# Altium schematic sheet Overall Schematic.SchDoc: StormNet Interface and Power Distribution
size C; PageSetup: Record=PageOptions|CenterHorizontal=True|CenterVertical=True|PrintScale=0.56|XCorrection=1.00|YCorrection=1.00|PrintKind=1|BorderSize=5000000|LeftOffset=0|BottomOffset=0|Orientation=2|PaperLength=1000|PaperWidth=1000|Scale=100|PaperSource=7|PrintQuality=-3|MediaType=1|DitherType=10|PrintScaleMode=1|PaperKind=Legal|PaperIndex=5
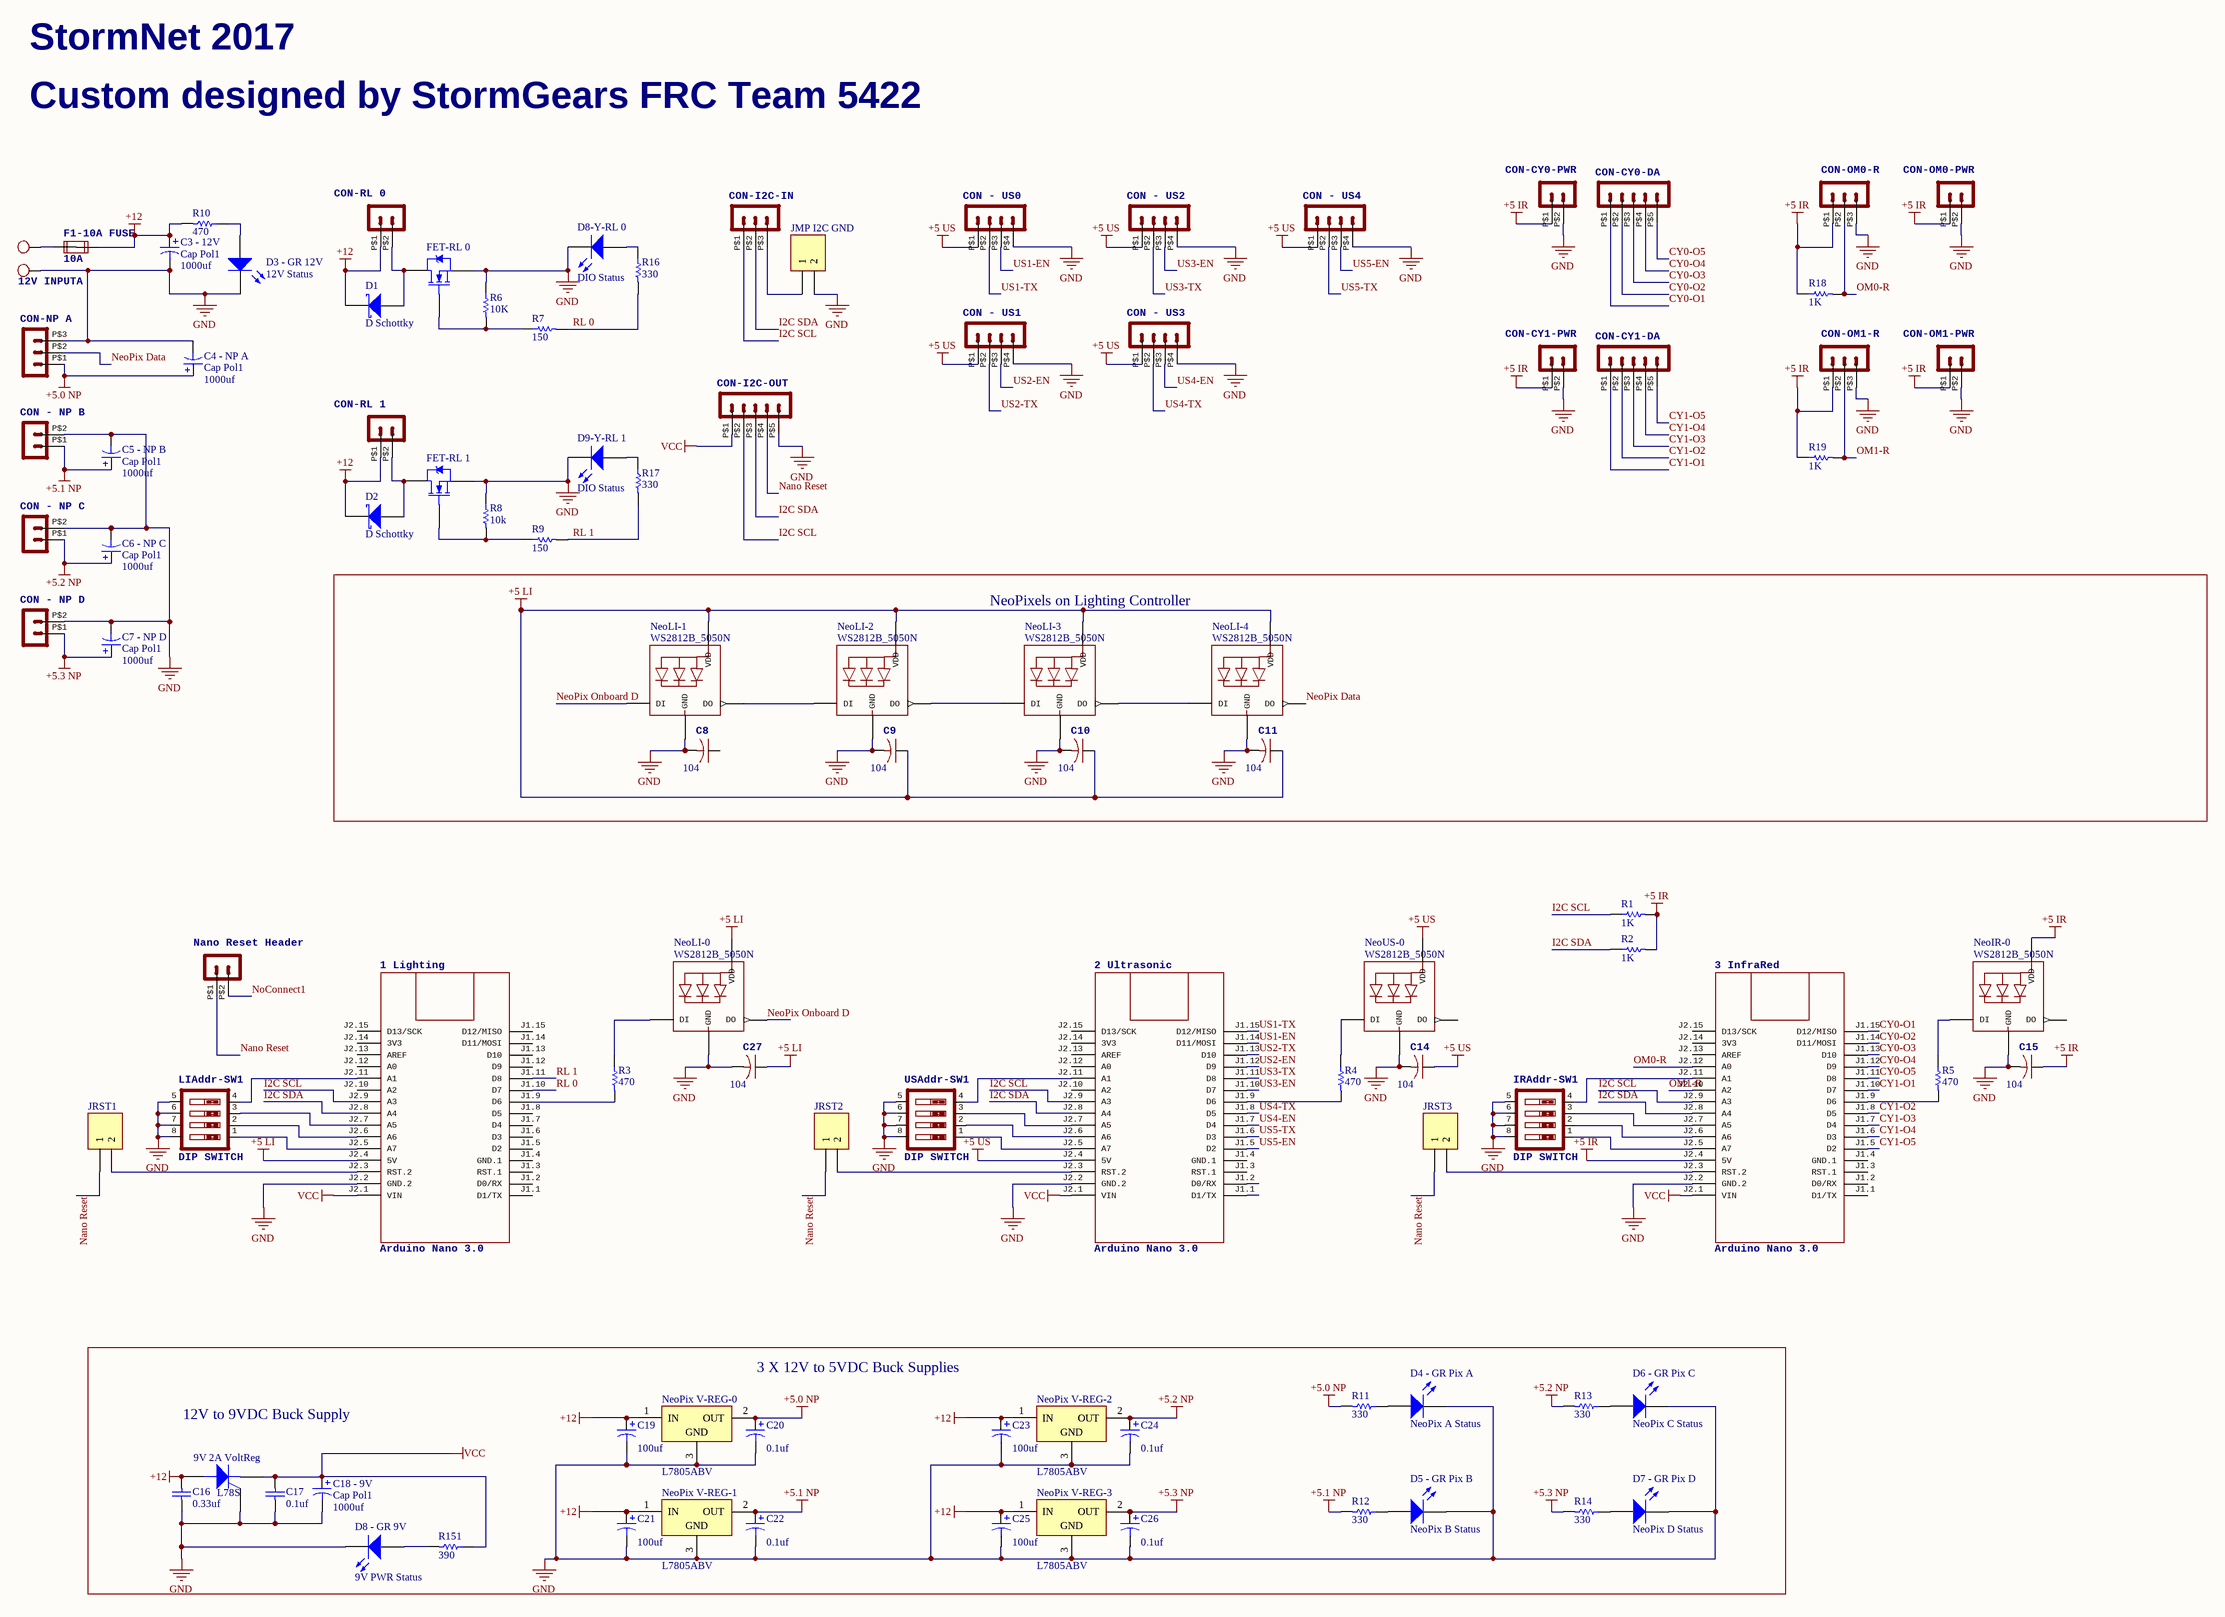
[diagram p0: Overall Schematic.SchDoc]

## Parts
1_Lighting  Arduino Nano 3.0  [ARDUINO-NANO-3.0]
2_Ultrasonic  Arduino Nano 3.0  [ARDUINO-NANO-3.0]
3_InfraRed  Arduino Nano 3.0  [ARDUINO-NANO-3.0]
9V_2A_VoltReg  L78S  [TO-220-AB]
12V_INPUT  MKDSN 1,5/ 2-5,08 Printklemme   Nennstrom: 13,5 A Nennspannung: 250 V Rastermaß: 5,08 mm Polzahl: 2 Anschlussart: Schraubanschluss Montage: Löten Anschlussrichtung Leiter/Platine: 0 ° Artikelnummer: 1729128 Source: http://eshop.phoenixcontact.com .. 1729128.pdf  [MKDSN1,5/2-5,08]  (value not drawn)  (part A of 2)
C3_-_12V  Cap Pol1  value 1000uf  [RB7.6-15]
C4_-_NP_A  Cap Pol1  value 1000uf  [RB7.6-15]
C5_-_NP_B  Cap Pol1  value 1000uf  [RB7.6-15]
C6_-_NP_C  Cap Pol1  value 1000uf  [RB7.6-15]
C7_-_NP_D  Cap Pol1  value 1000uf  [RB7.6-15]
C8  CAPACITOR, American symbol  [C0805]  (value not drawn)
C9  CAPACITOR, American symbol  [C0805]  (value not drawn)
C10  CAPACITOR, American symbol  [C0805]  (value not drawn)
C11  CAPACITOR, American symbol  [C0805]  (value not drawn)
C14  CAPACITOR, American symbol  [C0805]  (value not drawn)
C15  CAPACITOR, American symbol  [C0805]  (value not drawn)
C16  0.33uf  [C1206]
C17  0.1uf  [C1206]
C18_-_9V  Cap Pol1  value 1000uf  [RB7.6-15]
C19  value 100uf  [C0805]  (hidden comment: Cap Pol3)
C20  value 0.1uf  [C0805]  (hidden comment: Cap Pol3)
C21  value 100uf  [C0805]  (hidden comment: Cap Pol3)
C22  value 0.1uf  [C0805]  (hidden comment: Cap Pol3)
C23  value 100uf  [C0805]  (hidden comment: Cap Pol3)
C24  value 0.1uf  [C0805]  (hidden comment: Cap Pol3)
C25  value 100uf  [C0805]  (hidden comment: Cap Pol3)
C26  value 0.1uf  [C0805]  (hidden comment: Cap Pol3)
C27  CAPACITOR, American symbol  [C0805]  (value not drawn)
CON-CY0-DA  Molex SL  [70545-POS5]  (value not drawn)
CON-CY0-PWR  Molex -C-Grid® / SL Series connector   Wire-to-Board 2.54 mm (0.100") pitch header, 2 positions.  [70545-POS2]  (value not drawn)
CON-CY1-DA  Molex SL  [70545-POS5]  (value not drawn)
CON-CY1-PWR  Molex -C-Grid® / SL Series connector   Wire-to-Board 2.54 mm (0.100") pitch header, 2 positions.  [70545-POS2]  (value not drawn)
CON-I2C-IN  Molex -C-Grid® / SL Series connector   Wire-to-Board 2.54 mm (0.100") pitch header, 3 positions.  [70545-POS3]  (value not drawn)
CON-I2C-OUT  Molex SL  [70545-POS5]  (value not drawn)
CON-NP_A  Molex -C-Grid® / SL Series connector   Wire-to-Board 2.54 mm (0.100") pitch header, 3 positions.  [70545-POS3]  (value not drawn)
CON-OM0-PWR  Molex -C-Grid® / SL Series connector   Wire-to-Board 2.54 mm (0.100") pitch header, 2 positions.  [70545-POS2]  (value not drawn)
CON-OM0-R  Molex -C-Grid® / SL Series connector   Wire-to-Board 2.54 mm (0.100") pitch header, 3 positions.  [70545-POS3]  (value not drawn)
CON-OM1-PWR  Molex -C-Grid® / SL Series connector   Wire-to-Board 2.54 mm (0.100") pitch header, 2 positions.  [70545-POS2]  (value not drawn)
CON-OM1-R  Molex -C-Grid® / SL Series connector   Wire-to-Board 2.54 mm (0.100") pitch header, 3 positions.  [70545-POS3]  (value not drawn)
CON-RL_0  Molex -C-Grid® / SL Series connector   Wire-to-Board 2.54 mm (0.100") pitch header, 2 positions.  [70545-POS2]  (value not drawn)
CON-RL_1  Molex -C-Grid® / SL Series connector   Wire-to-Board 2.54 mm (0.100") pitch header, 2 positions.  [70545-POS2]  (value not drawn)
CON_-_NP_B  Molex -C-Grid® / SL Series connector   Wire-to-Board 2.54 mm (0.100") pitch header, 2 positions.  [70545-POS2]  (value not drawn)
CON_-_NP_C  Molex -C-Grid® / SL Series connector   Wire-to-Board 2.54 mm (0.100") pitch header, 2 positions.  [70545-POS2]  (value not drawn)
CON_-_NP_D  Molex -C-Grid® / SL Series connector   Wire-to-Board 2.54 mm (0.100") pitch header, 2 positions.  [70545-POS2]  (value not drawn)
CON_-_US0  Molex -C-Grid® / SL Series connector   Wire-to-Board 2.54 mm (0.100") pitch header, 4 positions.  [70545-POS4]  (value not drawn)
CON_-_US1  Molex -C-Grid® / SL Series connector   Wire-to-Board 2.54 mm (0.100") pitch header, 4 positions.  [70545-POS4]  (value not drawn)
CON_-_US2  Molex -C-Grid® / SL Series connector   Wire-to-Board 2.54 mm (0.100") pitch header, 4 positions.  [70545-POS4]  (value not drawn)
CON_-_US3  Molex -C-Grid® / SL Series connector   Wire-to-Board 2.54 mm (0.100") pitch header, 4 positions.  [70545-POS4]  (value not drawn)
CON_-_US4  Molex -C-Grid® / SL Series connector   Wire-to-Board 2.54 mm (0.100") pitch header, 4 positions.  [70545-POS4]  (value not drawn)
D1  D Schottky  [SMB]
D2  D Schottky  [SMB]
D3_-_GR_12V  12V Status  [3.2X1.6X1.1]
D4_-_GR_Pix_A  NeoPix A Status  [3.2X1.6X1.1]
D5_-_GR_Pix_B  NeoPix B Status  [3.2X1.6X1.1]
D6_-_GR_Pix_C  NeoPix C Status  [3.2X1.6X1.1]
D7_-_GR_Pix_D  NeoPix D Status  [3.2X1.6X1.1]
D8-Y-RL_0  DIO Status  [3.2X1.6X1.1]
D8_-_GR_9V  9V PWR Status  [3.2X1.6X1.1]
D9-Y-RL_1  DIO Status  [3.2X1.6X1.1]
F1-10A_FUSE  10A  [FUSE1]
FET-RL_0  NMOS-2  [TO-220AB]  (value not drawn)
FET-RL_1  NMOS-2  [TO-220AB]  (value not drawn)
IRAddr-SW1  DIP SWITCH  [EDG-04]
JMP_I2C_GND  Header 2  [HDR1X2]  (value not drawn)
JRST1  Header 2  [HDR1X2]  (value not drawn)
JRST2  Header 2  [HDR1X2]  (value not drawn)
JRST3  Header 2  [HDR1X2]  (value not drawn)
LIAddr-SW1  DIP SWITCH  [EDG-04]
Nano_Reset_Header  Molex -C-Grid® / SL Series connector   Wire-to-Board 2.54 mm (0.100") pitch header, 2 positions.  [70545-POS2]  (value not drawn)
NeoIR-0  WS2812B_5050N  [WS2812B-NARROW]
NeoLI-0  WS2812B_5050N  [WS2812B-NARROW]
NeoLI-1  WS2812B_5050N  [WS2812B-NARROW]
NeoLI-2  WS2812B_5050N  [WS2812B-NARROW]
NeoLI-3  WS2812B_5050N  [WS2812B-NARROW]
NeoLI-4  WS2812B_5050N  [WS2812B-NARROW]
NeoPix_V-REG-0  L7805ABV  [TO220ABN]
NeoPix_V-REG-1  L7805ABV  [TO220ABN]
NeoPix_V-REG-2  L7805ABV  [TO220ABN]
NeoPix_V-REG-3  L7805ABV  [TO220ABN]
NeoUS-0  WS2812B_5050N  [WS2812B-NARROW]
R1  value 1K  [AXIAL-0.3]  (hidden comment: Res1)
R2  value 1K  [AXIAL-0.3]  (hidden comment: Res1)
R3  470  [AXIAL-0.3]
R4  470  [AXIAL-0.3]
R5  470  [AXIAL-0.3]
R6  10K  [AXIAL-0.3]
R7  150  [AXIAL-0.3]
R8  10k  [AXIAL-0.3]
R9  150  [AXIAL-0.3]
R10  470  [AXIAL-0.3]
R11  330  [AXIAL-0.3]
R12  330  [AXIAL-0.3]
R13  330  [AXIAL-0.3]
R14  330  [AXIAL-0.3]
R16  330  [AXIAL-0.3]
R17  330  [AXIAL-0.3]
R18  value 1K  [AXIAL-0.3]  (hidden comment: Res1)
R19  value 1K  [AXIAL-0.3]  (hidden comment: Res1)
R151  390  [AXIAL-0.3]
USAddr-SW1  DIP SWITCH  [EDG-04]

## Blocks framed on the sheet
NeoPixels on Lighting Controller: C8-C11 NeoLI-1-NeoLI-4

## Nets
+5 IR: 3_InfraRed.J2.4(5V) C15.1 CON-CY0-PWR.P$1 CON-CY1-PWR.P$1 CON-OM0-PWR.P$1 CON-OM0-R.P$1 CON-OM1-PWR.P$1 CON-OM1-R.P$1 NeoIR-0.1-VDD(VDD) R1.2 R2.2 R18.1 R19.1
+5 LI: 1_Lighting.J2.4(5V) C9.1 C10.1 C11.1 C27.1 NeoLI-0.1-VDD(VDD) NeoLI-1.1-VDD(VDD) NeoLI-2.1-VDD(VDD) NeoLI-3.1-VDD(VDD) NeoLI-4.1-VDD(VDD)
+5 US: 2_Ultrasonic.J2.4(5V) C14.1 CON_-_US0.P$1 CON_-_US1.P$1 CON_-_US2.P$1 CON_-_US3.P$1 CON_-_US4.P$1 NeoUS-0.1-VDD(VDD)
+5.0 NP: C4_-_NP_A.1 C20.1 CON-NP_A.P$1 NeoPix_V-REG-0.2(OUT) R11.2
+5.1 NP: C5_-_NP_B.1 C22.1 CON_-_NP_B.P$1 NeoPix_V-REG-1.2(OUT) R12.2
+5.2 NP: C6_-_NP_C.1 C24.1 CON_-_NP_C.P$1 NeoPix_V-REG-2.2(OUT) R13.2
+5.3 NP: C7_-_NP_D.1 C26.1 CON_-_NP_D.P$1 NeoPix_V-REG-3.2(OUT) R14.2
+12: 9V_2A_VoltReg.1(A) C3_-_12V.1 C16.2 C19.1 C21.1 C23.1 C25.1 CON-RL_0.P$1 CON-RL_1.P$1 D1.2(K) D2.2(K) F1-10A_FUSE.2A NeoPix_V-REG-0.1(IN) NeoPix_V-REG-1.1(IN) NeoPix_V-REG-2.1(IN) NeoPix_V-REG-3.1(IN) R10.2
GND: 1_Lighting.J2.2(GND.2) 2_Ultrasonic.J2.2(GND.2) 3_InfraRed.J2.2(GND.2) 9V_2A_VoltReg.2(G) 12V_INPUT.1(KL) C3_-_12V.2 C4_-_NP_A.2 C5_-_NP_B.2 C6_-_NP_C.2 C7_-_NP_D.2 C8.2 C9.2 C10.2 C11.2 C14.2 C15.2 C16.1 C17.1 C18_-_9V.2 C19.2 C20.2 C21.2 C22.2 C23.2 C24.2 C25.2 C26.2 C27.2 CON-CY0-PWR.P$2 CON-CY1-PWR.P$2 CON-I2C-OUT.P$5 CON-NP_A.P$3 CON-OM0-PWR.P$2 CON-OM0-R.P$3 CON-OM1-PWR.P$2 CON-OM1-R.P$3 CON_-_NP_B.P$2 CON_-_NP_C.P$2 CON_-_NP_D.P$2 CON_-_US0.P$4 CON_-_US1.P$4 CON_-_US2.P$4 CON_-_US3.P$4 CON_-_US4.P$4 D3_-_GR_12V.2(K) D4_-_GR_Pix_A.2(K) D5_-_GR_Pix_B.2(K) D6_-_GR_Pix_C.2(K) D7_-_GR_Pix_D.2(K) D8-Y-RL_0.2(K) D8_-_GR_9V.2(K) D9-Y-RL_1.2(K) FET-RL_0.3(S) FET-RL_1.3(S) IRAddr-SW1.5 IRAddr-SW1.6 IRAddr-SW1.7 IRAddr-SW1.8 JMP_I2C_GND.2 LIAddr-SW1.5 LIAddr-SW1.6 LIAddr-SW1.7 LIAddr-SW1.8 NeoIR-0.3-GND(GND) NeoLI-0.3-GND(GND) NeoLI-1.3-GND(GND) NeoLI-2.3-GND(GND) NeoLI-3.3-GND(GND) NeoLI-4.3-GND(GND) NeoPix_V-REG-0.3(GND) NeoPix_V-REG-1.3(GND) NeoPix_V-REG-2.3(GND) NeoPix_V-REG-3.3(GND) NeoUS-0.3-GND(GND) R6.1 R8.1 USAddr-SW1.5 USAddr-SW1.6 USAddr-SW1.7 USAddr-SW1.8
VCC: 1_Lighting.J2.1(VIN) 2_Ultrasonic.J2.1(VIN) 3_InfraRed.J2.1(VIN) 9V_2A_VoltReg.3(K) C17.2 C18_-_9V.1 CON-I2C-OUT.P$1 R151.1
CY0-O1: 3_InfraRed.J1.15(D12/MISO) CON-CY0-DA.P$1
CY0-O2: 3_InfraRed.J1.14(D11/MOSI) CON-CY0-DA.P$2
CY0-O3: 3_InfraRed.J1.13(D10) CON-CY0-DA.P$3
CY0-O4: 3_InfraRed.J1.12(D9) CON-CY0-DA.P$4
CY0-O5: 3_InfraRed.J1.11(D8) CON-CY0-DA.P$5
CY1-O1: 3_InfraRed.J1.10(D7) CON-CY1-DA.P$1
CY1-O2: 3_InfraRed.J1.8(D5) CON-CY1-DA.P$2
CY1-O3: 3_InfraRed.J1.7(D4) CON-CY1-DA.P$3
CY1-O4: 3_InfraRed.J1.6(D3) CON-CY1-DA.P$4
CY1-O5: 3_InfraRed.J1.5(D2) CON-CY1-DA.P$5
I2C SCL: 1_Lighting.J2.9(A3) 2_Ultrasonic.J2.9(A3) 3_InfraRed.J2.9(A3) CON-I2C-IN.P$1 CON-I2C-OUT.P$2 R1.1
I2C SDA: 1_Lighting.J2.8(A4) 2_Ultrasonic.J2.8(A4) 3_InfraRed.J2.8(A4) CON-I2C-IN.P$2 CON-I2C-OUT.P$3 R2.1
Nano Reset: CON-I2C-OUT.P$4 JRST1.1 JRST2.1 JRST3.1 Nano_Reset_Header.P$1
NeoPix Data: CON-NP_A.P$2 NeoLI-4.2-DOUT(DO)
NeoPix Onboard D: NeoLI-0.2-DOUT(DO) NeoLI-1.4-DIN(DI)
NoConnect1: Nano_Reset_Header.P$2
OM0-R: 3_InfraRed.J2.12(A0) CON-OM0-R.P$2 R18.2
OM1-R: 3_InfraRed.J2.10(A2) CON-OM1-R.P$2 R19.2
RL 0: 1_Lighting.J1.10(D7) R7.2 R16.2
RL 1: 1_Lighting.J1.11(D8) R9.2 R17.2
US1-EN: 2_Ultrasonic.J1.14(D11/MOSI) CON_-_US0.P$3
US1-TX: 2_Ultrasonic.J1.15(D12/MISO) CON_-_US0.P$2
US2-EN: 2_Ultrasonic.J1.12(D9) CON_-_US1.P$3
US2-TX: 2_Ultrasonic.J1.13(D10) CON_-_US1.P$2
US3-EN: 2_Ultrasonic.J1.10(D7) CON_-_US2.P$3
US3-TX: 2_Ultrasonic.J1.11(D8) CON_-_US2.P$2
US4-EN: 2_Ultrasonic.J1.7(D4) CON_-_US3.P$3
US4-TX: 2_Ultrasonic.J1.8(D5) CON_-_US3.P$2
US5-EN: 2_Ultrasonic.J1.5(D2) CON_-_US4.P$3
US5-TX: 2_Ultrasonic.J1.6(D3) CON_-_US4.P$2
Net1_Lighting_J1.9: 1_Lighting.J1.9(D6) R3.2
Net1_Lighting_J2.3: 1_Lighting.J2.3(RST.2) JRST1.2
Net1_Lighting_J2.5: 1_Lighting.J2.5(A7) LIAddr-SW1.1
Net1_Lighting_J2.6: 1_Lighting.J2.6(A6) LIAddr-SW1.2
Net1_Lighting_J2.7: 1_Lighting.J2.7(A5) LIAddr-SW1.3
Net1_Lighting_J2.11: 1_Lighting.J2.11(A1) LIAddr-SW1.4
Net2_Ultrasonic_J1.9: 2_Ultrasonic.J1.9(D6) R4.2
Net2_Ultrasonic_J2.3: 2_Ultrasonic.J2.3(RST.2) JRST2.2
Net2_Ultrasonic_J2.5: 2_Ultrasonic.J2.5(A7) USAddr-SW1.1
Net2_Ultrasonic_J2.6: 2_Ultrasonic.J2.6(A6) USAddr-SW1.2
Net2_Ultrasonic_J2.7: 2_Ultrasonic.J2.7(A5) USAddr-SW1.3
Net2_Ultrasonic_J2.11: 2_Ultrasonic.J2.11(A1) USAddr-SW1.4
Net3_InfraRed_J1.9: 3_InfraRed.J1.9(D6) R5.2
Net3_InfraRed_J2.3: 3_InfraRed.J2.3(RST.2) JRST3.2
Net3_InfraRed_J2.5: 3_InfraRed.J2.5(A7) IRAddr-SW1.1
Net3_InfraRed_J2.6: 3_InfraRed.J2.6(A6) IRAddr-SW1.2
Net3_InfraRed_J2.7: 3_InfraRed.J2.7(A5) IRAddr-SW1.3
Net3_InfraRed_J2.11: 3_InfraRed.J2.11(A1) IRAddr-SW1.4
Net12V_INPUT_2: 12V_INPUT.2(KL) F1-10A_FUSE.1A
NetCON-I2C-IN_P$3: CON-I2C-IN.P$3 JMP_I2C_GND.1
NetCON-RL_0_P$2: CON-RL_0.P$2 D1.1(A) FET-RL_0.2(D)
NetCON-RL_1_P$2: CON-RL_1.P$2 D2.1(A) FET-RL_1.2(D)
NetD3_-_GR_12V_1: D3_-_GR_12V.1(A) R10.1
NetD4_-_GR_Pix_A_1: D4_-_GR_Pix_A.1(A) R11.1
NetD5_-_GR_Pix_B_1: D5_-_GR_Pix_B.1(A) R12.1
NetD6_-_GR_Pix_C_1: D6_-_GR_Pix_C.1(A) R13.1
NetD7_-_GR_Pix_D_1: D7_-_GR_Pix_D.1(A) R14.1
NetD8-Y-RL_0_1: D8-Y-RL_0.1(A) R16.1
NetD8_-_GR_9V_1: D8_-_GR_9V.1(A) R151.2
NetD9-Y-RL_1_1: D9-Y-RL_1.1(A) R17.1
NetFET-RL_0_1: FET-RL_0.1(G) R6.2 R7.1
NetFET-RL_1_1: FET-RL_1.1(G) R8.2 R9.1
NetNeoIR-0_4-DIN: NeoIR-0.4-DIN(DI) R5.1
NetNeoLI-0_4-DIN: NeoLI-0.4-DIN(DI) R3.1
NetNeoLI-1_2-DOUT: NeoLI-1.2-DOUT(DO) NeoLI-2.4-DIN(DI)
NetNeoLI-2_2-DOUT: NeoLI-2.2-DOUT(DO) NeoLI-3.4-DIN(DI)
NetNeoLI-3_2-DOUT: NeoLI-3.2-DOUT(DO) NeoLI-4.4-DIN(DI)
NetNeoUS-0_4-DIN: NeoUS-0.4-DIN(DI) R4.1

Not connected (* = marked no-connect by the designer): 1_Lighting J1.1(D1/TX) J1.2(D0/RX) J1.3(RST.1) J1.4(GND.1) J1.5(D2) J1.6(D3) J1.7(D4) J1.8(D5) J1.12(D9) J1.13(D10) J1.14(D11/MOSI) J1.15(D12/MISO) J2.10(A2) J2.12(A0) J2.13(AREF) J2.14(3V3) J2.15(D13/SCK); 2_Ultrasonic J1.1(D1/TX) J1.2(D0/RX) J1.3(RST.1) J1.4(GND.1) J2.10(A2) J2.12(A0) J2.13(AREF) J2.14(3V3) J2.15(D13/SCK); 3_InfraRed J1.1(D1/TX) J1.2(D0/RX) J1.3(RST.1) J1.4(GND.1) J2.13(AREF) J2.14(3V3) J2.15(D13/SCK); C8 1; F1-10A_FUSE 1B 2B; NeoIR-0 2-DOUT(DO); NeoUS-0 2-DOUT(DO)

## Notes on the sheet
- StormNet 2017
- Custom designed by StormGears FRC Team 5422
- 3 X 12V to 5VDC Buck Supplies
- 12V to 9VDC Buck Supply
- (in symbol C-USC0805) 104

## Library data of the parts
1_Lighting 2_Ultrasonic 3_InfraRed = ARDUINO-NANO-3.0
9V_2A_VoltReg = SCR: Silicon Controlled Rectifier; Published: 8-Jun-2000; LatestRevisionDate: 17-Jul-2002; LatestRevisionNote: Re-released for DXP Platform.; PackageReference: TO-220-AB; Publisher: Altium Limited; Code_JEDEC: TO-220-AB
12V_INPUT = MKDSN1,5/2-5,08
C3_-_12V C4_-_NP_A C5_-_NP_B C6_-_NP_C C7_-_NP_D C18_-_9V = Cap Pol1: Polarized Capacitor (Radial); Published: 8-Jun-2000; LatestRevisionDate: 17-Jul-2002; LatestRevisionNote: Re-released for DXP Platform.; PackageReference: RB7.6-15; Publisher: Altium Limited; PackageDescription: Polarized Capacitor (Radial); 2 Leads
C8-C11 C14 C15 C27 = C-USC0805
C16 C17 = Cap Semi: Capacitor (Semiconductor SIM Model); Published: 8-Jun-2000; LatestRevisionDate: 29-May-2009; LatestRevisionNote: IPC-7351 Footprint Added.; PackageReference: C1206; Publisher: Altium Limited; PackageDescription: Chip Capacitor
  C16: Value: 0.33uf
  C17: Value: 0.1uf
C19-C26 = Cap Pol3: Polarized Capacitor (Surface Mount); Published: 8-Jun-2000; LatestRevisionDate: 29-May-2009; LatestRevisionNote: IPC-7351 Footprint Added.; PackageReference: C0805; Publisher: Altium Limited; PackageDescription: Chip Capacitor
CON-CY0-DA CON-CY1-DA CON-I2C-OUT = HEADER_POS5_?70634
CON-CY0-PWR CON-CY1-PWR CON-OM0-PWR CON-OM1-PWR CON-RL_0 CON-RL_1 CON_-_NP_B CON_-_NP_C CON_-_NP_D Nano_Reset_Header = HEADER_POS2_?70634
CON-I2C-IN = HEADER_POS3_?70634
CON-NP_A CON-OM0-R CON-OM1-R = HEADER_POS3_?70545
CON_-_US0-CON_-_US4 = HEADER_POS4_?70634
D1 D2 = D Schottky: Schottky Diode; Published: 8-Jun-2000; LatestRevisionDate: 17-Jul-2002; LatestRevisionNote: Re-released for DXP Platform.; PackageReference: SMB; Publisher: Altium Limited; PackageDescription: DO-214-AA/SMB; 2 C-Bend Leads; Body 5.3 x 3.6 mm, inc. leads (LxW); Code_JEDEC: DO-214-AA
D3_-_GR_12V D4_-_GR_Pix_A D5_-_GR_Pix_B D6_-_GR_Pix_C D7_-_GR_Pix_D D8-Y-RL_0 D8_-_GR_9V D9-Y-RL_1 = LED2: Typical RED, GREEN, YELLOW, AMBER GaAs LED; Published: 8-Jun-2000; LatestRevisionDate: 17-Jul-2002; LatestRevisionNote: Re-released for DXP Platform.; PackageVersion: Feb-2002; PackageReference: 3.2X1.6X1.1; Publisher: Altium Limited; PackageDescription: SM LED; 2 Flat Leads
F1-10A_FUSE = FUSE2P: VALUE: 10A
FET-RL_0 FET-RL_1 = NMOS-2: N-Channel Power MOSFET; Note: Pin 2 is electrically connected to pin 4.; Published: 8-Jun-2000; LatestRevisionDate: 17-Jul-2002; LatestRevisionNote: Re-released for DXP Platform.; DatasheetVersion: PD-9.814; PackageVersion: Feb-1997; PackageReference: TO-220AB; Publisher: Altium Limited; PackageDescription: TO, Thru-Hole, Vertical, Heatsink Mounted; 3 In-Line Leads; Pitch 2.54 mm; ComponentLink1Description: Manufacturer Link; ComponentLink1URL: http://www.irf.com/
IRAddr-SW1 LIAddr-SW1 USAddr-SW1 = SW_DIP-4
JMP_I2C_GND JRST1-JRST3 = Header 2: Header, 2-Pin; LatestRevisionDate: 17-Jul-2002; LatestRevisionNote: Re-released for DXP Platform.; Publisher: Altium Limited
NeoPix_V-REG-0-NeoPix_V-REG-3 = L7805ABV: Precision 1A Regulator; Note: Tab is connected to pin 3 (GND).; Published: 24-Aug-2001; LatestRevisionDate: 17-Jul-2002; LatestRevisionNote: Re-released for DXP Platform.; DatasheetVersion: Nov-1999; PackageVersion: Jun-1998; PackageReference: TO220ABN; Publisher: Altium Limited; PackageDescription: TO, Thru-Hole, Vertical, Heatsink Mounted; 3 In-Line Leads; Pitch 2.54 mm; Pin sequence 1, 3, 2; ComponentLink1Description: Manufacturer Link; ComponentLink1URL: http://www.st.com/; ComponentLink2Description: Datasheet; ComponentLink2URL: http://www.st.com/stonline/products/literature/ds/2144/l7805ab.pdf
R1-R14 R16-R19 R151 = Res1: Resistor; Published: 8-Jun-2000; LatestRevisionDate: 17-Jul-2002; LatestRevisionNote: Re-released for DXP Platform.; PackageReference: AXIAL-0.3; Publisher: Altium Limited; PackageDescription: Axial Device, Thru-Hole; 2 Leads; 0.3 in Pin Spacing
  R3-R5 R10: Value: 470
  R6: Value: 10K
  R7 R9: Value: 150
  R8: Value: 10k
  R11-R14 R16 R17: Value: 330
  R151: Value: 390